# Altium project Mantra.PrjPcb
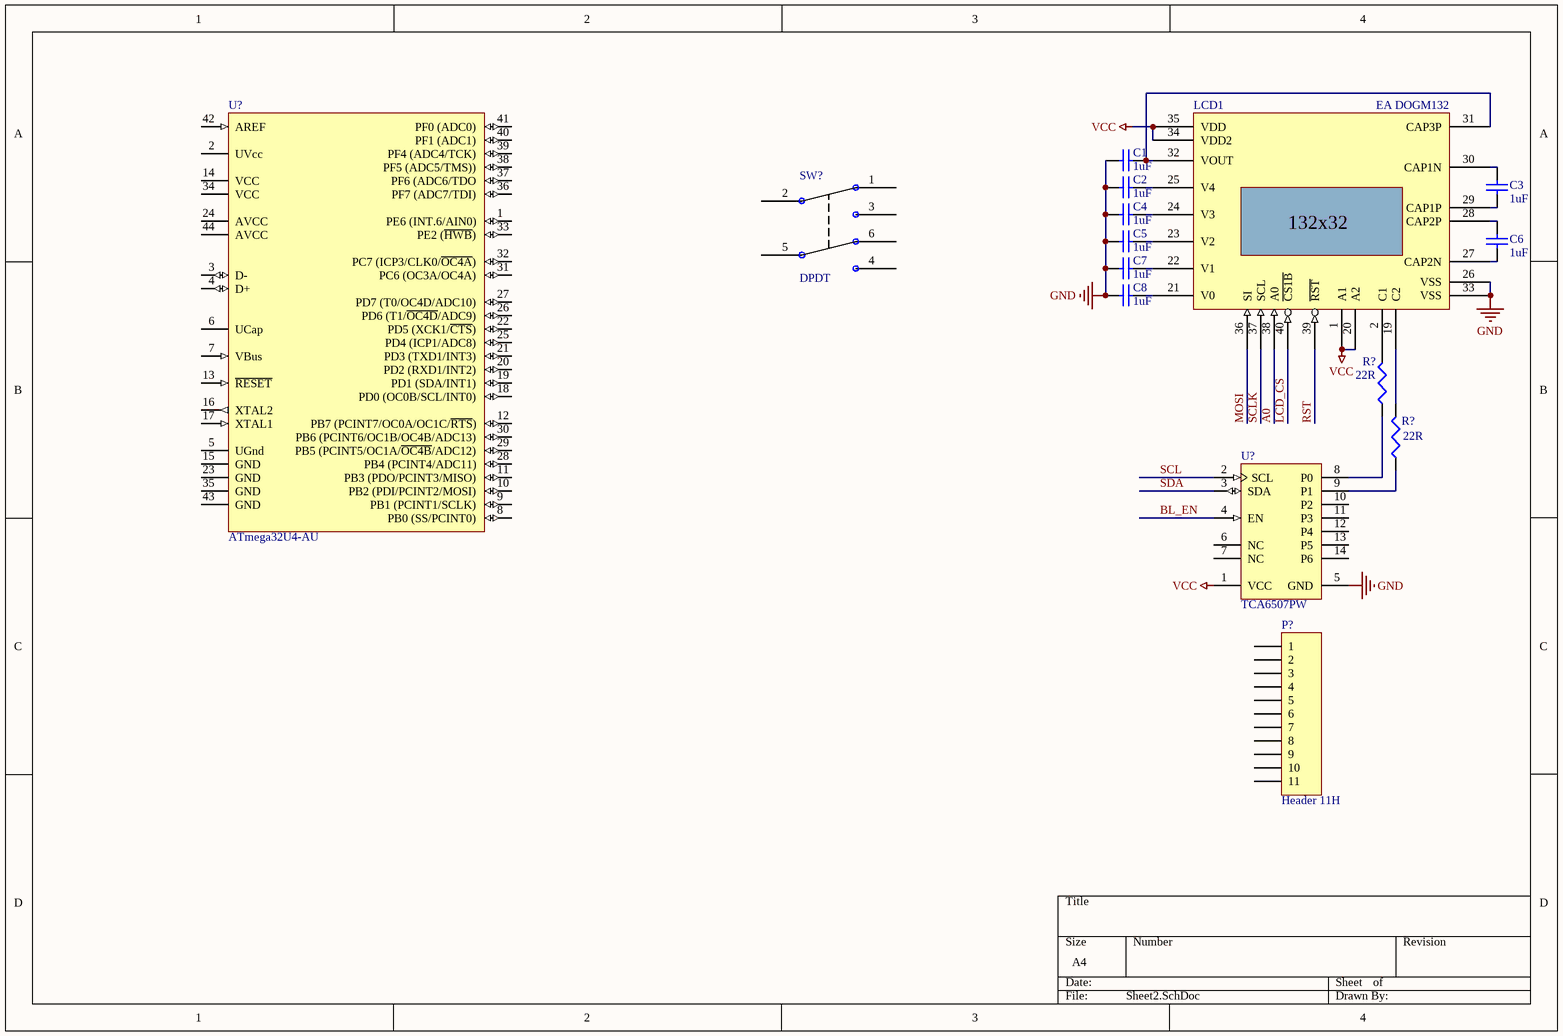
[diagram p0: Sheet2.SchDoc]
10 sheets, 15 parts. Net scope: global (net labels, ports and power ports of the same name join across sheets).
Board file: PCB1.PcbDoc
Sheets:
  Sheet2.SchDoc
  Mantra2017 Project.SchDoc
    Designator = [01] - Cover Page.SchDoc
    Designator = [02] - Block Diagram.SchDoc
    Designator = [03] - CPU.SchDoc
    Designator = [04] - USB.SchDoc
    Designator = [05] - PwrMgmt.SchDoc
    Designator = [06] - LCD.SchDoc
    Designator = [07] - Keyboard.SchDoc
    Designator = [08] - Memory.SchDoc

## Sheet Sheet2.SchDoc
size A4; DocumentNumber: 10; SheetNumber: 10; SheetTotal: 10

### Parts
(Parts that share a designator on the sheet are numbered #1, #2 ... from top to bottom, then left to right.)
C1  value 1uF  [1608[0603]]  (hidden comment: Cap Semi)
C2  value 1uF  [1608[0603]]  (hidden comment: Cap Semi)
C3  value 1uF  [1608[0603]]  (hidden comment: Cap Semi)
C4  value 1uF  [1608[0603]]  (hidden comment: Cap Semi)
C5  value 1uF  [1608[0603]]  (hidden comment: Cap Semi)
C6  value 1uF  [1608[0603]]  (hidden comment: Cap Semi)
C7  value 1uF  [1608[0603]]  (hidden comment: Cap Semi)
C8  value 1uF  [1608[0603]]  (hidden comment: Cap Semi)
LCD1  EA DOGM132  [EA DOGM132-5]
P?  Header 11H  [HDR1X11H]
R?#1  value 22R  [J1-0603]  (hidden comment: Res3)
R?#2  value 22R  [J1-0603]  (hidden comment: Res3)
SW?  DPDT  [SW-EG2215]
U?#1  ATmega32U4-AU  [44ML_N]
U?#2  TCA6507PW  [PW14_M]

### Nets
GND: C1.1 C2.1 C4.1 C5.1 C7.1 C8.1 LCD1.26(VSS) LCD1.33(VSS) U?#2.5(GND)
VCC: LCD1.1(A1) LCD1.20(A2) LCD1.34(VDD2) LCD1.35(VDD) U?#2.1(VCC)
A0: LCD1.38(A0)
BL_EN: U?#2.4(EN)
LCD_CS: LCD1.40(~{CS1B})
MOSI: LCD1.36(SI)
RST: LCD1.39(~{RST})
SCL: U?#2.2(SCL)
SCLK: LCD1.37(SCL)
SDA: U?#2.3(SDA)
NetC1_2: C1.2 LCD1.31(CAP3P) LCD1.32(VOUT)
NetC2_2: C2.2 LCD1.25(V4)
NetC3_1: C3.1 LCD1.30(CAP1N)
NetC3_2: C3.2 LCD1.29(CAP1P)
NetC4_2: C4.2 LCD1.24(V3)
NetC5_2: C5.2 LCD1.23(V2)
NetC6_1: C6.1 LCD1.28(CAP2P)
NetC6_2: C6.2 LCD1.27(CAP2N)
NetC7_2: C7.2 LCD1.22(V1)
NetC8_2: C8.2 LCD1.21(V0)
NetLCD1_2: LCD1.2(C1) R?#1.2
NetLCD1_19: LCD1.19(C2) R?#2.2
NetR?#1_1: R?#1.1 U?#2.8(P0)
NetR?#2_1: R?#2.1 U?#2.9(P1)

Not connected (* = marked no-connect by the designer): P? 1 2 3 4 5 6 7 8 9 10 11; SW? 1(NC-1) 2(CC-1) 3(NO-1) 4(NO-2) 5(CC-2) 6(NC-2); U?#1 1(PE6_(INT.6/AIN0)) 2(UVcc) 3(D-) 4(D+) 5(UGnd) 6(UCap) 7(VBus) 8(PB0_(SS/PCINT0)) 9(PB1_(PCINT1/SCLK)) 10(PB2_(PDI/PCINT2/MOSI)) 11(PB3_(PDO/PCINT3/MISO)) 12(PB7_(PCINT7/OC0A/OC1C/~{RTS})) 13(~{RESET}) 14(VCC) 15(GND) 16(XTAL2) 17(XTAL1) 18(PD0_(OC0B/SCL/INT0)) 19(PD1_(SDA/INT1)) 20(PD2_(RXD1/INT2)) 21(PD3_(TXD1/INT3)) 22(PD5_(XCK1/~{CTS})) 23(GND) 24(AVCC) 25(PD4_(ICP1/ADC8)) 26(PD6_(T1/~{OC4D}/ADC9)) 27(PD7_(T0/OC4D/ADC10)) 28(PB4_(PCINT4/ADC11)) 29(PB5_(PCINT5/OC1A/~{OC4B}/ADC12)) 30(PB6_(PCINT6/OC1B/OC4B/ADC13)) 31(PC6_(OC3A/OC4A)) 32(PC7_(ICP3/CLK0/~{OC4A})) 33(PE2_(~{HWB})) 34(VCC) 35(GND) 36(PF7_(ADC7/TDI)) 37(PF6_(ADC6/TDO) 38(PF5_(ADC5/TMS))) 39(PF4_(ADC4/TCK)) 40(PF1_(ADC1)) 41(PF0_(ADC0)) 42(AREF) 43(GND) 44(AVCC); U?#2 6(NC) 7(NC) 10(P2) 11(P3) 12(P4) 13(P5) 14(P6)

### Notes on the sheet
- (in symbol EA DOGM132) 132x32

### Library data of the parts
C1-C8 = Cap Semi: Capacitor (Semiconductor SIM Model); Published: 8-Jun-2000; LatestRevisionDate: 29-May-2009; LatestRevisionNote: IPC-7351 Footprint Added.; PackageReference: C1206; Publisher: Altium Limited; PackageDescription: Chip Capacitor
LCD1 = EA DOGM132: 132x32 graphical LCD
P? = Header 11H: Header, 11-Pin, Right Angle; LatestRevisionDate: 17-Jul-2002; LatestRevisionNote: Re-released for DXP Platform.; Publisher: Altium Limited
R?#1 R?#2 = Res3: Resistor; Published: 8-Jun-2000; LatestRevisionDate: 29-May-2009; LatestRevisionNote: IPC-7351 Footprint Added.; PackageReference: J1-0603; Publisher: Altium Limited; PackageDescription: Chip Resistor
SW? = SW-DPDT
U?#1 = ATmega32U4-AU: 8-bit AVR Microcontroller, 2.7-5.5V, 16MHz, 32KB Flash, 1KB EEPROM, 2.5KB SRAM, USB Controller, 44-pin TQFP, Industrial Grade (-40°C to 85°C), Ext Osc; DatasheetVersion: revF, Nov-2010; PackageVersion: rev.G, Jul-2007; PackageReference: 44ML; PackageDescription: 44-Pin Plastic Thin Quad Flat Pack, 10 x 10 x 1.0 mm Body, 0.8 mm Pitch (TQFP); ComponentLink1Description: Manufacturer URL; ComponentLink1URL: http://www.atmel.com/; ComponentLink2Description: ATmega16U4/32U4 Datasheet; ComponentLink2URL: http://www.atmel.com/dyn/resources/prod_documents/doc7766.pdf; ComponentLink3Description: ATmega16U4 ATmega32U4 Summary; ComponentLink3URL: http://www.atmel.com/dyn/resources/prod_documents/7766S.pdf
U?#2 = TCA6507PW: Low-Voltage 7-Bit I2C and SMBus LED Driver with Intensity Control and Shutdown, 1.65 to 3.6 V, -40 to 85 degC, 14-pin TSSOP (PW), Green (RoHS & no Sb/Br); Manufacturer: Texas Instruments; SubFamily: I2C Special Function; fSCLK(Max)(MHz): 400; VCC(Min)(V): 1.65; VCC(Max)(V): 3.6; I2C Address: 1000101; Enable Pin: Yes; Rating: Catalog; DatasheetVersion: SCPS164B; PackageVersion: revG, Feb-2011; PackageReference: PW14; PackageDescription: 14-Pin Thin Small Outline Package 0.65 mm Pitch; Supplier 1: Digi-Key; Supplier Part Number 1: TCA6507PW-ND; Supplier 2: Farnell; Supplier Part Number 2: 1647813; Supplier 3: Newark; Supplier Part Number 3: 54M7301; Supplier 4: Mouser; Supplier Part Number 4: 595-TCA6507PW; Eco-Plan: Green (RoHS & no Sb/Br); Max Frequency(kHz): 400; Function: LED Driver; Vcc range(V): 1.65 to 3.6; Open Drain I/O Type: Yes; 5V Tolerant I/O: Yes; On-Chip Power-on-Reset: Yes; Mounting Technology: Surface Mount; PartNumber: TCA6507PW; Code_JEDEC: MO-153; ComponentLink1Description: Datasheet; ComponentLink1URL: http://www.ti.com/general/docs/lit/getliterature.tsp?genericPartNumber=TCA6507&fileType=pdf; ComponentLink2Description: Package Specification; ComponentLink2URL: http://www.ti.com/litv/pdf/mpds177g

## Sheet Mantra2017 Project.SchDoc: Mantra 2017
size A4; Author: MikrySoft; DocumentNumber: 1; Revision: 1; SheetNumber: 1; SheetTotal: 10
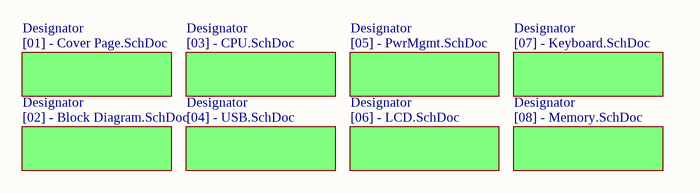
[diagram p1: Mantra2017 Project.SchDoc]

### Sub-sheets
Designator = [01] - Cover Page.SchDoc: no entries
Designator = [02] - Block Diagram.SchDoc: no entries
Designator = [03] - CPU.SchDoc: no entries
Designator = [04] - USB.SchDoc: no entries
Designator = [05] - PwrMgmt.SchDoc: no entries
Designator = [06] - LCD.SchDoc: no entries
Designator = [07] - Keyboard.SchDoc: no entries
Designator = [08] - Memory.SchDoc: no entries

### Notes on the sheet
- Title
- Size:
- Date:
- A4
- Number:
- Time:
- Revision:
- Sheet
- of
- File:

## Sheet [01] - Cover Page.SchDoc
size A4; DocumentNumber: 2; SheetNumber: 2; SheetTotal: 10

### Notes on the sheet
- Title
- Size:
- Date:
- A4
- Number:
- Time:
- Revision:
- Sheet
- of
- File:

## Sheet [02] - Block Diagram.SchDoc
size A4; DocumentNumber: 3; SheetNumber: 3; SheetTotal: 10

## Sheet [03] - CPU.SchDoc
size A4; DocumentNumber: 4; SheetNumber: 4; SheetTotal: 10

## Sheet [04] - USB.SchDoc
size A4; DocumentNumber: 5; SheetNumber: 5; SheetTotal: 10

## Sheet [05] - PwrMgmt.SchDoc
size A4; DocumentNumber: 6; SheetNumber: 6; SheetTotal: 10

## Sheet [06] - LCD.SchDoc
size A4; DocumentNumber: 7; SheetNumber: 7; SheetTotal: 10

## Sheet [07] - Keyboard.SchDoc
size A4; DocumentNumber: 8; SheetNumber: 8; SheetTotal: 10

## Sheet [08] - Memory.SchDoc
size A4; DocumentNumber: 9; SheetNumber: 9; SheetTotal: 10